# Altium schematic sheet voltage regulators.SchDoc
size A; SheetNumber: 1; SheetTotal: 2
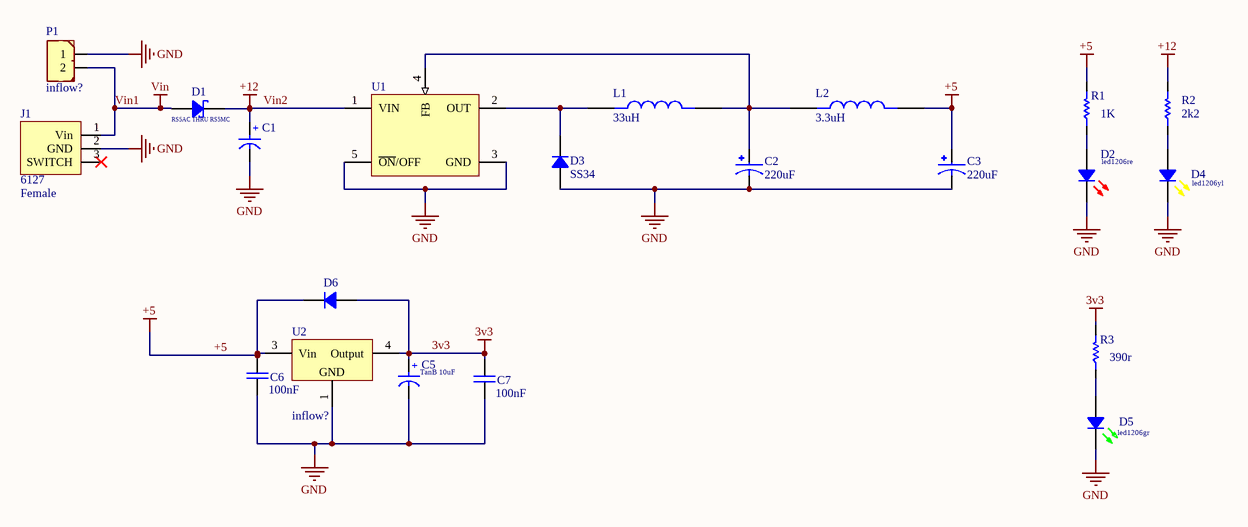
[diagram p0: voltage regulators.SchDoc]

## Parts
C1  1000u'F, 25'V  [Cap electrolitic radial 10x20-5]  (value not drawn)
C2  220uF  [PCBComponent_1]
C3  220uF  [PCBComponent_1]
C5  TanB 10uF  [SMT_C_Tantalum_B]
C6  100nF  [CAP 1206/3216]
C7  100nF  [CAP 1206/3216]
D1  RS5AC THRU RS5MC  [DO-214AB(SMC)]
D2  led1206re  [LED 1206/3216 RED]
D3  SS34  [SS34]
D4  led1206yl  [LED 1206/3216 YELLOW]
D5  led1206gr  [LED 1206/3216 GREEN]
D6  1N4148  [LL4148]  (value not drawn)
J1  Inflow: 6127  [Power Jack BIG]  (hidden comment: Female)
L1  33uH  [Ind7.3x6.6]
L2  3.3uH  [IND5.3x5.3]
P1  Inflow: inflow?  [Phoenix_2PIN_RA_P5.08mm]  (hidden comment: 2'Pin)
R1  1K  [RES 1206 (3216X08L)]
R2  2k2  [RES 1206 (3216X08L)]
R3  390r  [RES 1206 (3216X08L)]
U1  lm2596-5vCTE  [D2PAK_TO-263-5]  (value not drawn)
U2  Inflow: inflow?  [TO252-3N]  (hidden comment: AMS1117CD)

## Nets
3v3: C5.1(+) C7.1 D6.1 R3.2 U2.4(Output)
+5: C3.1 C6.1 D6.2 L2.2 R1.2 U2.3(Vin)
GND: C1.2(-) C2.2 C3.2 C5.2(-) C6.2 C7.2 D2.2 D3.1 D4.2 D5.2 J1.2(GND) P1.1 U1.3(GND) U1.5(~{ON}/OFF) U2.1(GND)
Vin1: D1.1 J1.1(Vin) P1.2  [also labelled Vin]
Vin2: C1.1(+) D1.2 R2.2 U1.1(VIN)  [also labelled +12]
NetC2_1: C2.1 L1.2 L2.1 U1.4(FB)
NetD2_1: D2.1 R1.1
NetD3_2: D3.2 L1.1 U1.2(OUT)
NetD4_1: D4.1 R2.1
NetD5_1: D5.1 R3.1

Not connected (* = marked no-connect by the designer): J1 3(SWITCH)*

## Library data of the parts
C1 = Cap_Elec_1000u_25: Electrolit Capacitor; Inflow: 4225; Rating: Rating?; Type: Type?; Validation: NT; Value: 1000u'F, 25'V; Package: Package?
C2 C3 = Cap_SMD7x7
C5 = Cap_Tantalum: Tantalum Capacitor,TAJ Series-SMD; Inflow: inflow?; Validation: Valid; Rating: Rating?; Value: Value?; Package: Package?; Type: Tantalum
C6 C7 = Cap_Multi_22p_50_1206: Bipolar ceramic capacitor SMD; Value: 22p'F, 50'V; Rating: Rating?; Type: Type?; Validation: Valid; Inflow: 5240; Package: Package?
D1 = Semi_Diod_Sch_SK54: Surface Mount Fast Recovery Rectifiers / Reverse Voltage - 50 to 1000 V / Forward Current - 5 A; Type: Schottky; Rating: Rating?; Value: SK54; Validation: Valid; Inflow: 5230; Package: SMC
D2 = Semi_LED_Red_1206: LED; Inflow: 5253; Rating: Rating?; Type: Type?; Validation: Valid; Value: Red, 1206; Package: Package?
D3 = SS34: Schottky Rectifiers; Rating: Rating?; Value: SK54; Validation: Valid; Type: Schottky; Package: SMC; Arsham: SS34
D4 = Semi_LED_Yellow_1206: LED; Rating: Rating?; Type: Type?; Validation: Valid; Inflow: 5250; Value: Yellow, 1206; Package: Package?
D5 = Semi_LED_Green_1206: LED; Rating: Rating?; Type: Type?; Validation: Valid; Inflow: 5247; Value: Green, 1206; Package: Package?
D6 = Semi_Diod_STD_1N4148_MELF: High Conductance Fast Diode; Rating: Rating?; Type: Type?; Validation: NT; Inflow: 6205; Value: 1N4148; Package: Package?
J1 = Con_Power_Jack: Power Jack; Rating: Rating?; Validation: Valid; Type: Type?; Package: Package?; Value: Female
L1 = IND 7.3x7.3: Isat=2.5A / (ohm)max. 240 m-Ohm  @ 100kHz
L2 = IND 5.3x5.3: Isat=1.74A / (ohm)max. .0.037 @ 100kHz
P1 = Con_Power_2: Power Connector 2'Pin; Rating: Rating?; Validation: NT; Value: 2'Pin; Package: Package?; Type: Type?
R1 R3 = Res_SMD_1206: Resistor; Inflow: inflow?; Rating: 0.25W; Validation: Valid; Value: Value?; Package: 1206; Type: 10%
R2 = Res_SMD: Resistor; Inflow: inflow?; Rating: Rating?; Validation: Valid; Value: Value?; Package: Package?; Type: 10%
U1 = IC_Reg_LM2596: Simple switcher 3'A step-down voltage regulator; Value: Value?; Rating: S; Validation: Valid; Inflow: inflow?; Type: Switching; Package: TO-263
U2 = IC_Reg_AMS1117_CD: 800mA LOW DROPOUT VOLTAGE REGULATOR; Rating: Rating?; Validation: NT; Value: AMS1117CD; Package: Package?; Type: Type?